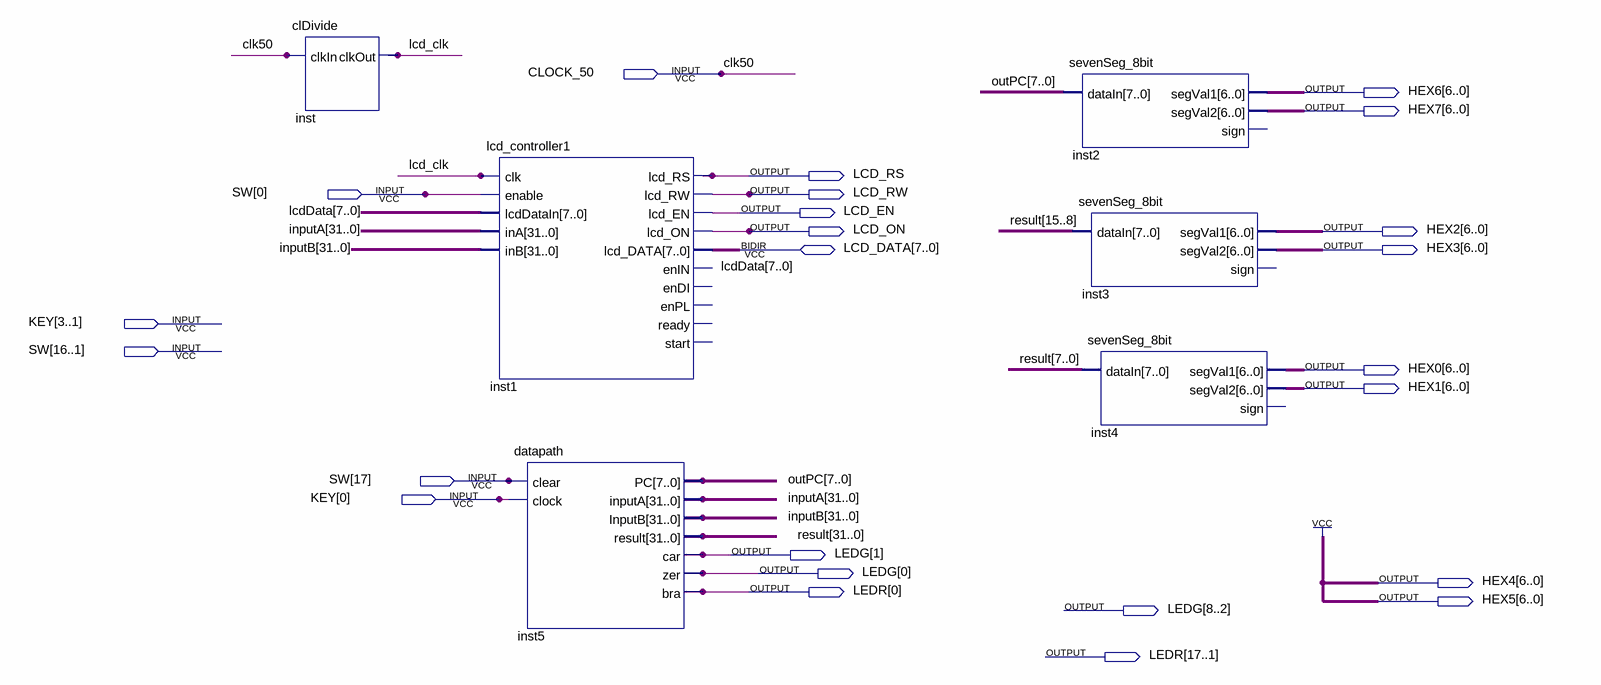
[diagram p0: schematic sheet]
// Quartus schematic final_project.bdf as structural Verilog: 6 symbols, 24 pins
module final_project (
  input  CLOCK_50,
  input  [17:0] SW,
  input  [3:0] KEY,
  inout  [7:0] LCD_DATA,
  output [6:0] HEX6,
  output [6:0] HEX7,
  output LCD_RS,
  output LCD_RW,
  output LCD_EN,
  output LCD_ON,
  output [6:0] HEX2,
  output [6:0] HEX3,
  output [6:0] HEX0,
  output [6:0] HEX1,
  output [8:0] LEDG,
  output [6:0] HEX4,
  output [17:0] LEDR,
  output [6:0] HEX5
);

  wire lcd_clk;
  wire [7:0] outPC;
  wire [31:0] inputA, inputB, result;

  clDivide inst (.clkIn(CLOCK_50), .clkOut(lcd_clk));
  lcd_controller1 inst1 (
    .clk(lcd_clk), .enable(SW[0]), .lcdDataIn(LCD_DATA), .inA(inputA), .inB(inputB), .lcd_RS(LCD_RS),
    .lcd_RW(LCD_RW), .lcd_EN(LCD_EN), .lcd_ON(LCD_ON), .lcd_DATA(LCD_DATA));  // open: enIN, enDI, enPL, ready, start
  datapath inst5 (
    .clear(SW[17]), .clock(KEY[0]), .PC(outPC), .inputA(inputA), .InputB(inputB), .result(result),
    .car(LEDG[1]), .zer(LEDG[0]), .bra(LEDR[0]));
  sevenSeg_8bit inst2 (.dataIn(outPC), .segVal1(HEX6), .segVal2(HEX7));  // open: sign
  sevenSeg_8bit inst3 (.dataIn(result[15:8]), .segVal1(HEX2), .segVal2(HEX3));  // open: sign
  sevenSeg_8bit inst4 (.dataIn(result[7:0]), .segVal1(HEX0), .segVal2(HEX1));  // open: sign

  assign HEX4 = {7{1'b1}};
  assign HEX5 = {7{1'b1}};

  // Other names for the same wires on the sheet: clk50 = CLOCK_50; lcdData[7:0] = LCD_DATA
endmodule
